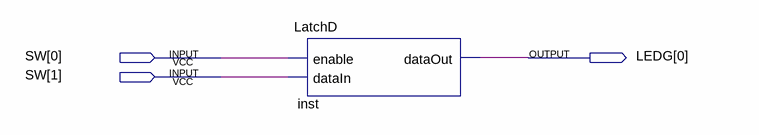
[diagram p0: schematic sheet]
// Quartus schematic Latch1BitTopLevel.bdf as structural Verilog: 1 symbols, 3 pins
module Latch1BitTopLevel (
  input  [1:0] SW,
  output [0:0] LEDG
);

  LatchD inst (.enable(SW[0]), .dataIn(SW[1]), .dataOut(LEDG[0]));
endmodule
